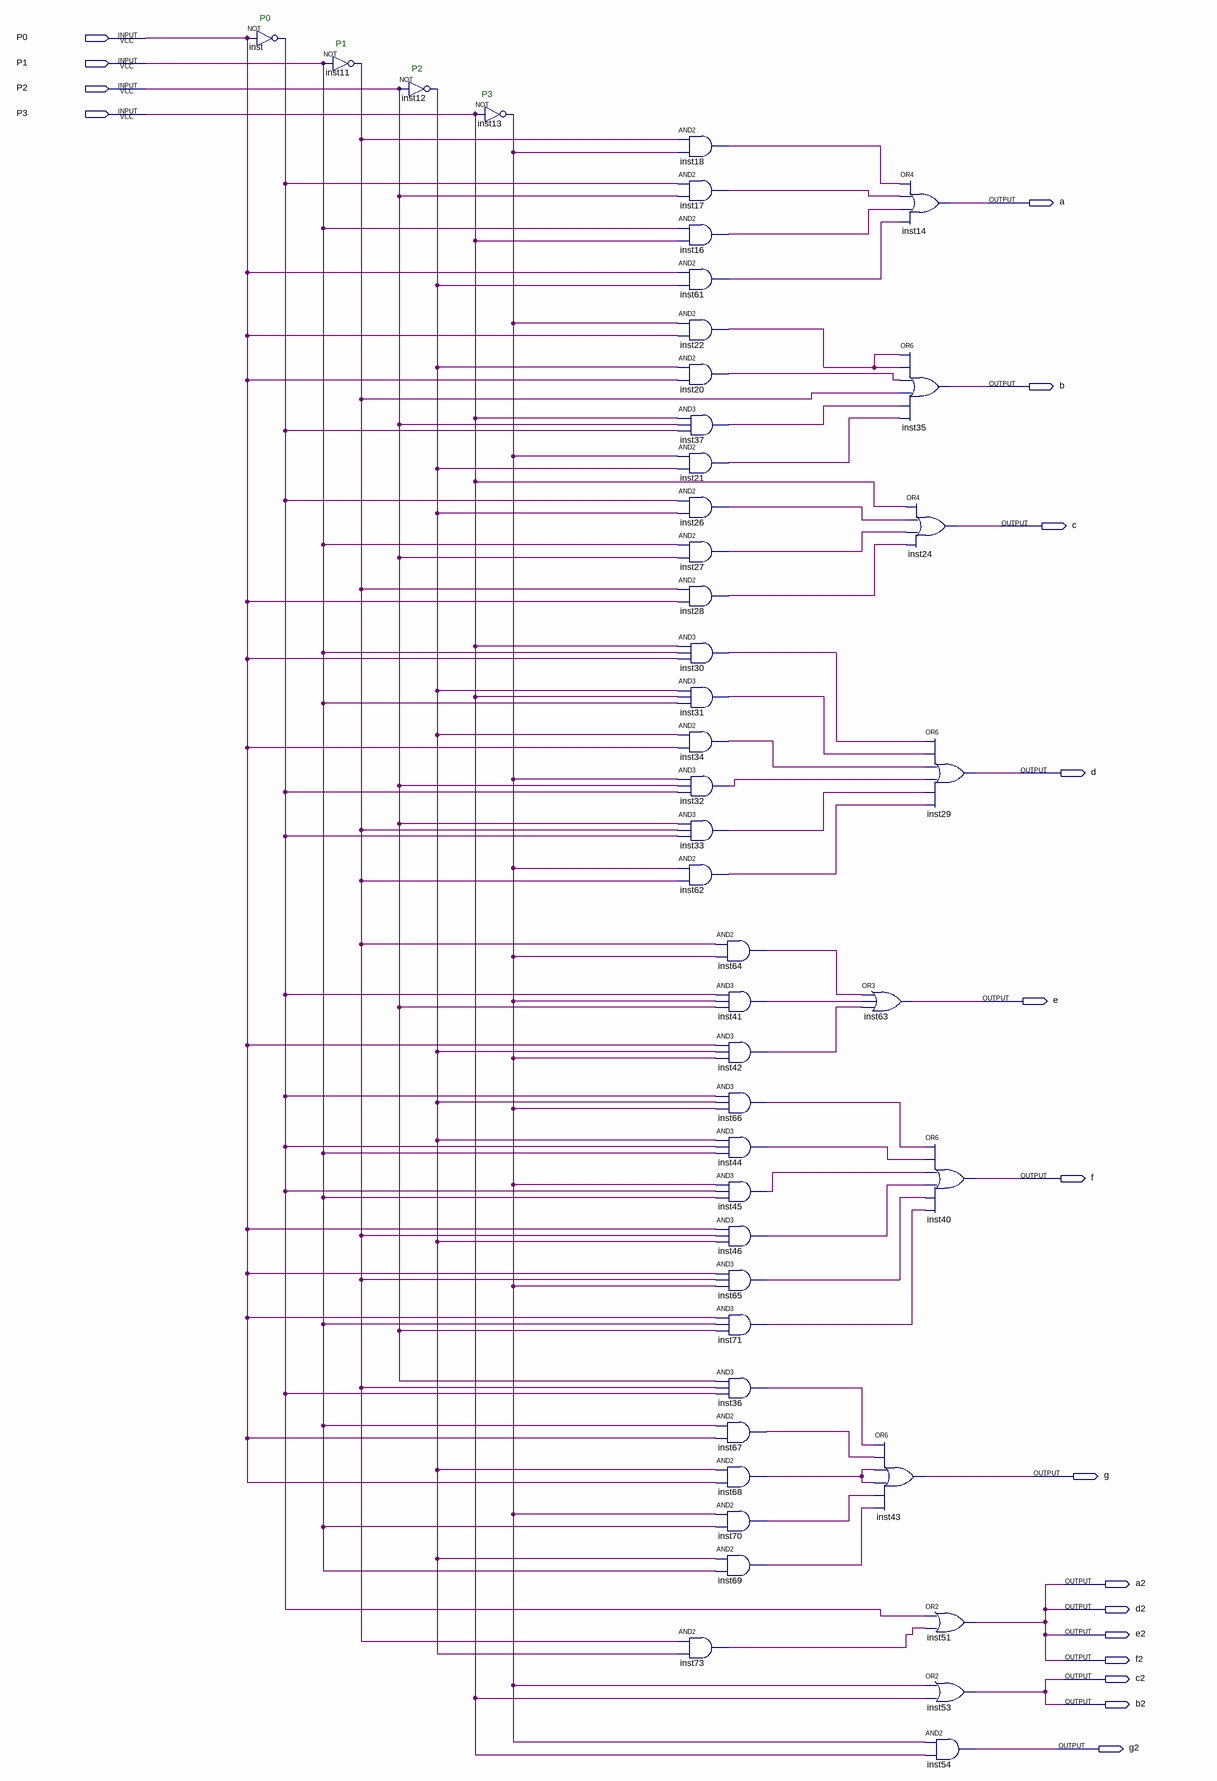
[diagram p0: schematic sheet]
// Quartus schematic SETE_SEGMENTOS.bdf as structural Verilog: 46 symbols, 18 pins
module SETE_SEGMENTOS (
  input  P0,
  input  P1,
  input  P2,
  input  P3,
  output a,
  output b,
  output c,
  output d,
  output e,
  output f,
  output g,
  output a2,
  output d2,
  output e2,
  output f2,
  output c2,
  output b2,
  output g2
);

  wire inst11_out, inst12_out, inst13_out, inst16_out, inst17_out, inst18_out, inst20_out, inst21_out,
       inst22_out, inst26_out, inst27_out, inst28_out, inst30_out, inst31_out, inst32_out, inst33_out,
       inst34_out, inst36_out, inst37_out, inst41_out, inst42_out, inst44_out, inst45_out, inst46_out,
       inst61_out, inst62_out, inst64_out, inst65_out, inst66_out, inst67_out, inst68_out, inst69_out,
       inst70_out, inst71_out, inst73_out, inst_out;

  not inst (inst_out, P0);
  not inst11 (inst11_out, P1);
  not inst12 (inst12_out, P2);
  not inst13 (inst13_out, P3);
  and inst18 (inst18_out, inst11_out, inst13_out);
  and inst17 (inst17_out, inst_out, P2);
  and inst16 (inst16_out, P1, P3);
  and inst61 (inst61_out, P0, inst12_out);
  and inst22 (inst22_out, inst13_out, P0);
  and inst20 (inst20_out, inst12_out, P0);
  and inst37 (inst37_out, P3, P2, inst_out);
  and inst21 (inst21_out, inst13_out, inst12_out);
  and inst26 (inst26_out, inst_out, inst12_out);
  and inst27 (inst27_out, P1, P2);
  and inst28 (inst28_out, inst11_out, P0);
  and inst30 (inst30_out, P3, P1, P0);
  and inst31 (inst31_out, inst12_out, P3, P1);
  and inst34 (inst34_out, inst12_out, P0);
  and inst32 (inst32_out, inst13_out, P2, inst_out);
  and inst33 (inst33_out, P2, inst11_out, inst_out);
  and inst62 (inst62_out, inst13_out, inst11_out);
  and inst73 (inst73_out, inst11_out, inst12_out);
  and inst64 (inst64_out, inst11_out, inst13_out);
  and inst41 (inst41_out, inst_out, inst13_out, P2);
  and inst42 (inst42_out, P0, inst12_out, inst13_out);
  and inst66 (inst66_out, inst_out, inst12_out, inst13_out);
  and inst44 (inst44_out, inst12_out, inst_out, P1);
  and inst45 (inst45_out, inst13_out, inst_out, P1);
  and inst46 (inst46_out, P0, inst11_out, inst12_out);
  and inst65 (inst65_out, P0, inst11_out, inst13_out);
  and inst71 (inst71_out, P0, P1, P2);
  and inst36 (inst36_out, P2, inst11_out, inst_out);
  and inst67 (inst67_out, P1, P0);
  and inst68 (inst68_out, inst12_out, P0);
  and inst70 (inst70_out, inst13_out, P1);
  and inst69 (inst69_out, inst12_out, P1);
  or inst63 (e, inst64_out, inst41_out, inst42_out);
  or inst43 (g, inst36_out, inst67_out, inst68_out, inst68_out, inst70_out, inst69_out);
  or inst14 (a, inst18_out, inst17_out, inst16_out, inst61_out);
  or inst35 (b, inst22_out, inst22_out, inst20_out, inst11_out, inst37_out, inst21_out);
  or inst24 (c, P3, inst26_out, inst27_out, inst28_out);
  or inst29 (d, inst30_out, inst31_out, inst34_out, inst32_out, inst33_out, inst62_out);
  or inst40 (f, inst66_out, inst44_out, inst45_out, inst46_out, inst65_out, inst71_out);
  or inst51 (a2, inst_out, inst73_out);
  or inst53 (b2, inst13_out, P3);
  and inst54 (g2, inst13_out, P3);

  assign c2 = b2;
  assign d2 = a2;
  assign e2 = a2;
  assign f2 = a2;

  // Notes on the sheet:
  //   P0
  //   P1
  //   P2
  //   P3
endmodule
